# Altium schematic sheet LED_1.SchDoc
size A4; SheetNumber: 4; SheetTotal: 5
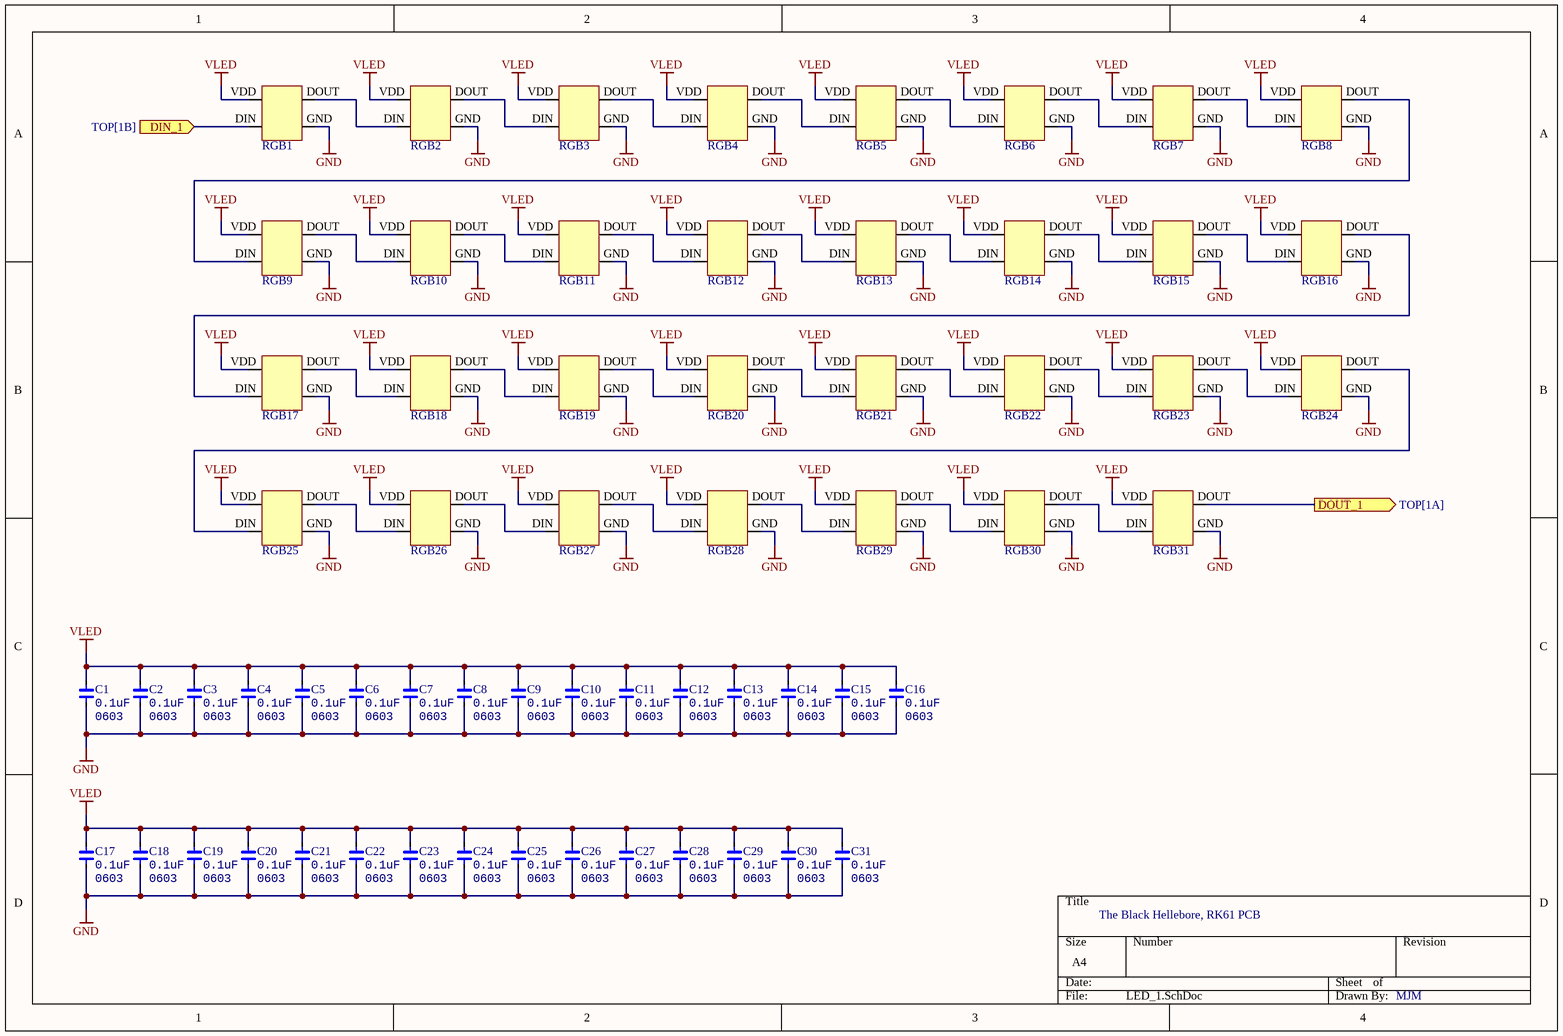
[diagram p0: LED_1.SchDoc]

## Parts
C1  value 0.1uF  Type: 0603  [FP-CC0603-DA-MFG]  (hidden comment: CC0603JRX7R9BB104)
C2  value 0.1uF  Type: 0603  [FP-CC0603-DA-MFG]  (hidden comment: CC0603JRX7R9BB104)
C3  value 0.1uF  Type: 0603  [FP-CC0603-DA-MFG]  (hidden comment: CC0603JRX7R9BB104)
C4  value 0.1uF  Type: 0603  [FP-CC0603-DA-MFG]  (hidden comment: CC0603JRX7R9BB104)
C5  value 0.1uF  Type: 0603  [FP-CC0603-DA-MFG]  (hidden comment: CC0603JRX7R9BB104)
C6  value 0.1uF  Type: 0603  [FP-CC0603-DA-MFG]  (hidden comment: CC0603JRX7R9BB104)
C7  value 0.1uF  Type: 0603  [FP-CC0603-DA-MFG]  (hidden comment: CC0603JRX7R9BB104)
C8  value 0.1uF  Type: 0603  [FP-CC0603-DA-MFG]  (hidden comment: CC0603JRX7R9BB104)
C9  value 0.1uF  Type: 0603  [FP-CC0603-DA-MFG]  (hidden comment: CC0603JRX7R9BB104)
C10  value 0.1uF  Type: 0603  [FP-CC0603-DA-MFG]  (hidden comment: CC0603JRX7R9BB104)
C11  value 0.1uF  Type: 0603  [FP-CC0603-DA-MFG]  (hidden comment: CC0603JRX7R9BB104)
C12  value 0.1uF  Type: 0603  [FP-CC0603-DA-MFG]  (hidden comment: CC0603JRX7R9BB104)
C13  value 0.1uF  Type: 0603  [FP-CC0603-DA-MFG]  (hidden comment: CC0603JRX7R9BB104)
C14  value 0.1uF  Type: 0603  [FP-CC0603-DA-MFG]  (hidden comment: CC0603JRX7R9BB104)
C15  value 0.1uF  Type: 0603  [FP-CC0603-DA-MFG]  (hidden comment: CC0603JRX7R9BB104)
C16  value 0.1uF  Type: 0603  [FP-CC0603-DA-MFG]  (hidden comment: CC0603JRX7R9BB104)
C17  value 0.1uF  Type: 0603  [FP-CC0603-DA-MFG]  (hidden comment: CC0603JRX7R9BB104)
C18  value 0.1uF  Type: 0603  [FP-CC0603-DA-MFG]  (hidden comment: CC0603JRX7R9BB104)
C19  value 0.1uF  Type: 0603  [FP-CC0603-DA-MFG]  (hidden comment: CC0603JRX7R9BB104)
C20  value 0.1uF  Type: 0603  [FP-CC0603-DA-MFG]  (hidden comment: CC0603JRX7R9BB104)
C21  value 0.1uF  Type: 0603  [FP-CC0603-DA-MFG]  (hidden comment: CC0603JRX7R9BB104)
C22  value 0.1uF  Type: 0603  [FP-CC0603-DA-MFG]  (hidden comment: CC0603JRX7R9BB104)
C23  value 0.1uF  Type: 0603  [FP-CC0603-DA-MFG]  (hidden comment: CC0603JRX7R9BB104)
C24  value 0.1uF  Type: 0603  [FP-CC0603-DA-MFG]  (hidden comment: CC0603JRX7R9BB104)
C25  value 0.1uF  Type: 0603  [FP-CC0603-DA-MFG]  (hidden comment: CC0603JRX7R9BB104)
C26  value 0.1uF  Type: 0603  [FP-CC0603-DA-MFG]  (hidden comment: CC0603JRX7R9BB104)
C27  value 0.1uF  Type: 0603  [FP-CC0603-DA-MFG]  (hidden comment: CC0603JRX7R9BB104)
C28  value 0.1uF  Type: 0603  [FP-CC0603-DA-MFG]  (hidden comment: CC0603JRX7R9BB104)
C29  value 0.1uF  Type: 0603  [FP-CC0603-DA-MFG]  (hidden comment: CC0603JRX7R9BB104)
C30  value 0.1uF  Type: 0603  [FP-CC0603-DA-MFG]  (hidden comment: CC0603JRX7R9BB104)
C31  value 0.1uF  Type: 0603  [FP-CC0603-DA-MFG]  (hidden comment: CC0603JRX7R9BB104)
RGB1  SK6812MINI-E  [sk6812minie]  (value not drawn)
RGB2  SK6812MINI-E  [sk6812minie]  (value not drawn)
RGB3  SK6812MINI-E  [sk6812minie]  (value not drawn)
RGB4  SK6812MINI-E  [sk6812minie]  (value not drawn)
RGB5  SK6812MINI-E  [sk6812minie]  (value not drawn)
RGB6  SK6812MINI-E  [sk6812minie]  (value not drawn)
RGB7  SK6812MINI-E  [sk6812minie]  (value not drawn)
RGB8  SK6812MINI-E  [sk6812minie]  (value not drawn)
RGB9  SK6812MINI-E  [sk6812minie]  (value not drawn)
RGB10  SK6812MINI-E  [sk6812minie]  (value not drawn)
RGB11  SK6812MINI-E  [sk6812minie]  (value not drawn)
RGB12  SK6812MINI-E  [sk6812minie]  (value not drawn)
RGB13  SK6812MINI-E  [sk6812minie]  (value not drawn)
RGB14  SK6812MINI-E  [sk6812minie]  (value not drawn)
RGB15  SK6812MINI-E  [sk6812minie]  (value not drawn)
RGB16  SK6812MINI-E  [sk6812minie]  (value not drawn)
RGB17  SK6812MINI-E  [sk6812minie]  (value not drawn)
RGB18  SK6812MINI-E  [sk6812minie]  (value not drawn)
RGB19  SK6812MINI-E  [sk6812minie]  (value not drawn)
RGB20  SK6812MINI-E  [sk6812minie]  (value not drawn)
RGB21  SK6812MINI-E  [sk6812minie]  (value not drawn)
RGB22  SK6812MINI-E  [sk6812minie]  (value not drawn)
RGB23  SK6812MINI-E  [sk6812minie]  (value not drawn)
RGB24  SK6812MINI-E  [sk6812minie]  (value not drawn)
RGB25  SK6812MINI-E  [sk6812minie]  (value not drawn)
RGB26  SK6812MINI-E  [sk6812minie]  (value not drawn)
RGB27  SK6812MINI-E  [sk6812minie]  (value not drawn)
RGB28  SK6812MINI-E  [sk6812minie]  (value not drawn)
RGB29  SK6812MINI-E  [sk6812minie]  (value not drawn)
RGB30  SK6812MINI-E  [sk6812minie]  (value not drawn)
RGB31  SK6812MINI-E  [sk6812minie]  (value not drawn)

## Ports
DIN_1 (in, see TOP[1B]), DOUT_1 (out, see TOP[1A])

## Nets
GND: C1.1 C2.1 C3.1 C4.1 C5.1 C6.1 C7.1 C8.1 C9.1 C10.1 C11.1 C12.1 C13.1 C14.1 C15.1 C16.1 C17.1 C18.1 C19.1 C20.1 C21.1 C22.1 C23.1 C24.1 C25.1 C26.1 C27.1 C28.1 C29.1 C30.1 C31.1 RGB1.GND RGB2.GND RGB3.GND RGB4.GND RGB5.GND RGB6.GND RGB7.GND RGB8.GND RGB9.GND RGB10.GND RGB11.GND RGB12.GND RGB13.GND RGB14.GND RGB15.GND RGB16.GND RGB17.GND RGB18.GND RGB19.GND RGB20.GND RGB21.GND RGB22.GND RGB23.GND RGB24.GND RGB25.GND RGB26.GND RGB27.GND RGB28.GND RGB29.GND RGB30.GND RGB31.GND
VLED: C1.2 C2.2 C3.2 C4.2 C5.2 C6.2 C7.2 C8.2 C9.2 C10.2 C11.2 C12.2 C13.2 C14.2 C15.2 C16.2 C17.2 C18.2 C19.2 C20.2 C21.2 C22.2 C23.2 C24.2 C25.2 C26.2 C27.2 C28.2 C29.2 C30.2 C31.2 RGB1.VDD RGB2.VDD RGB3.VDD RGB4.VDD RGB5.VDD RGB6.VDD RGB7.VDD RGB8.VDD RGB9.VDD RGB10.VDD RGB11.VDD RGB12.VDD RGB13.VDD RGB14.VDD RGB15.VDD RGB16.VDD RGB17.VDD RGB18.VDD RGB19.VDD RGB20.VDD RGB21.VDD RGB22.VDD RGB23.VDD RGB24.VDD RGB25.VDD RGB26.VDD RGB27.VDD RGB28.VDD RGB29.VDD RGB30.VDD RGB31.VDD
DIN_1: RGB1.DIN ; port DIN_1
DOUT_1: RGB31.DOUT ; port DOUT_1
NetRGB1_DOUT: RGB1.DOUT RGB2.DIN
NetRGB2_DOUT: RGB2.DOUT RGB3.DIN
NetRGB3_DOUT: RGB3.DOUT RGB4.DIN
NetRGB4_DOUT: RGB4.DOUT RGB5.DIN
NetRGB5_DOUT: RGB5.DOUT RGB6.DIN
NetRGB6_DOUT: RGB6.DOUT RGB7.DIN
NetRGB7_DOUT: RGB7.DOUT RGB8.DIN
NetRGB8_DOUT: RGB8.DOUT RGB9.DIN
NetRGB9_DOUT: RGB9.DOUT RGB10.DIN
NetRGB10_DOUT: RGB10.DOUT RGB11.DIN
NetRGB11_DOUT: RGB11.DOUT RGB12.DIN
NetRGB12_DOUT: RGB12.DOUT RGB13.DIN
NetRGB13_DOUT: RGB13.DOUT RGB14.DIN
NetRGB14_DOUT: RGB14.DOUT RGB15.DIN
NetRGB15_DOUT: RGB15.DOUT RGB16.DIN
NetRGB16_DOUT: RGB16.DOUT RGB17.DIN
NetRGB17_DOUT: RGB17.DOUT RGB18.DIN
NetRGB18_DOUT: RGB18.DOUT RGB19.DIN
NetRGB19_DOUT: RGB19.DOUT RGB20.DIN
NetRGB20_DOUT: RGB20.DOUT RGB21.DIN
NetRGB21_DOUT: RGB21.DOUT RGB22.DIN
NetRGB22_DOUT: RGB22.DOUT RGB23.DIN
NetRGB23_DOUT: RGB23.DOUT RGB24.DIN
NetRGB24_DOUT: RGB24.DOUT RGB25.DIN
NetRGB25_DOUT: RGB25.DOUT RGB26.DIN
NetRGB26_DOUT: RGB26.DOUT RGB27.DIN
NetRGB27_DOUT: RGB27.DOUT RGB28.DIN
NetRGB28_DOUT: RGB28.DOUT RGB29.DIN
NetRGB29_DOUT: RGB29.DOUT RGB30.DIN
NetRGB30_DOUT: RGB30.DOUT RGB31.DIN

## Notes on the sheet
- The Black Hellebore, RK61 PCB
- MJM

## Library data of the parts
C1-C31 = CMP-004-000009-6: 0603 0.1 uF 50 V ±5 % Tolerance X7R SMT Multilayer Ceramic Capacitor
RGB1-RGB31 = CMP-00002-18: RGB LED SK6812MINI-E; Source: SK6812MINI-E.SchLib; Design Item ID: SK6812MINI-E; Component Type: Standard; Pin Count: 4